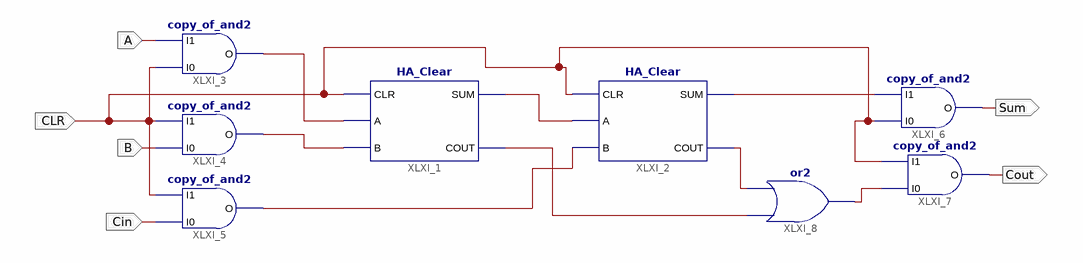
[diagram p0: schematic sheet 1]
// Xilinx ISE schematic FA_Clear.sch (artix7) as structural Verilog: 8 symbols, 6 ports
module FA_Clear (
  input  CLR,
  input  A,
  input  Cin,
  input  B,
  output Cout,
  output Sum
);

  wire XLXN_1, XLXN_2, XLXN_3, XLXN_4, XLXN_5, XLXN_6, XLXN_9, XLXN_14;

  HA_Clear XLXI_1 (.CLR(CLR), .A(XLXN_1), .B(XLXN_2), .SUM(XLXN_4), .COUT(XLXN_6));
  HA_Clear XLXI_2 (.CLR(CLR), .A(XLXN_4), .B(XLXN_3), .SUM(XLXN_14), .COUT(XLXN_5));
  copy_of_and2 XLXI_3 (.I0(CLR), .I1(A), .O(XLXN_1));
  copy_of_and2 XLXI_4 (.I0(B), .I1(CLR), .O(XLXN_2));
  copy_of_and2 XLXI_5 (.I0(Cin), .I1(CLR), .O(XLXN_3));
  copy_of_and2 XLXI_6 (.I0(CLR), .I1(XLXN_14), .O(Sum));
  copy_of_and2 XLXI_7 (.I0(XLXN_9), .I1(CLR), .O(Cout));
  or XLXI_8 (XLXN_9, XLXN_6, XLXN_5);
endmodule
